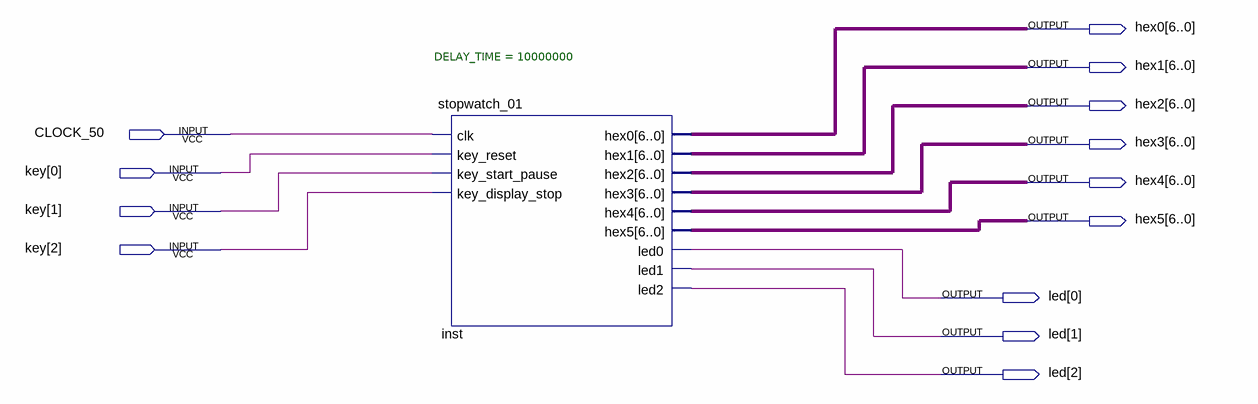
[diagram p0: schematic sheet]
// Quartus schematic stopwatch_retry.bdf as structural Verilog: 1 symbols, 13 pins
module stopwatch_retry (
  input  CLOCK_50,
  input  [2:0] key,
  output [6:0] hex0,
  output [6:0] hex1,
  output [6:0] hex2,
  output [6:0] hex3,
  output [6:0] hex4,
  output [6:0] hex5,
  output [2:0] led
);

  stopwatch_01 #(.DELAY_TIME(10000000)) inst (
    .clk(CLOCK_50), .key_reset(key[0]), .key_start_pause(key[1]), .key_display_stop(key[2]), .hex0(hex0),
    .hex1(hex1), .hex2(hex2), .hex3(hex3), .hex4(hex4), .hex5(hex5), .led0(led[0]), .led1(led[1]),
    .led2(led[2]));
endmodule
